# EAGLE schematic controller (EAGLE 8.4.1)
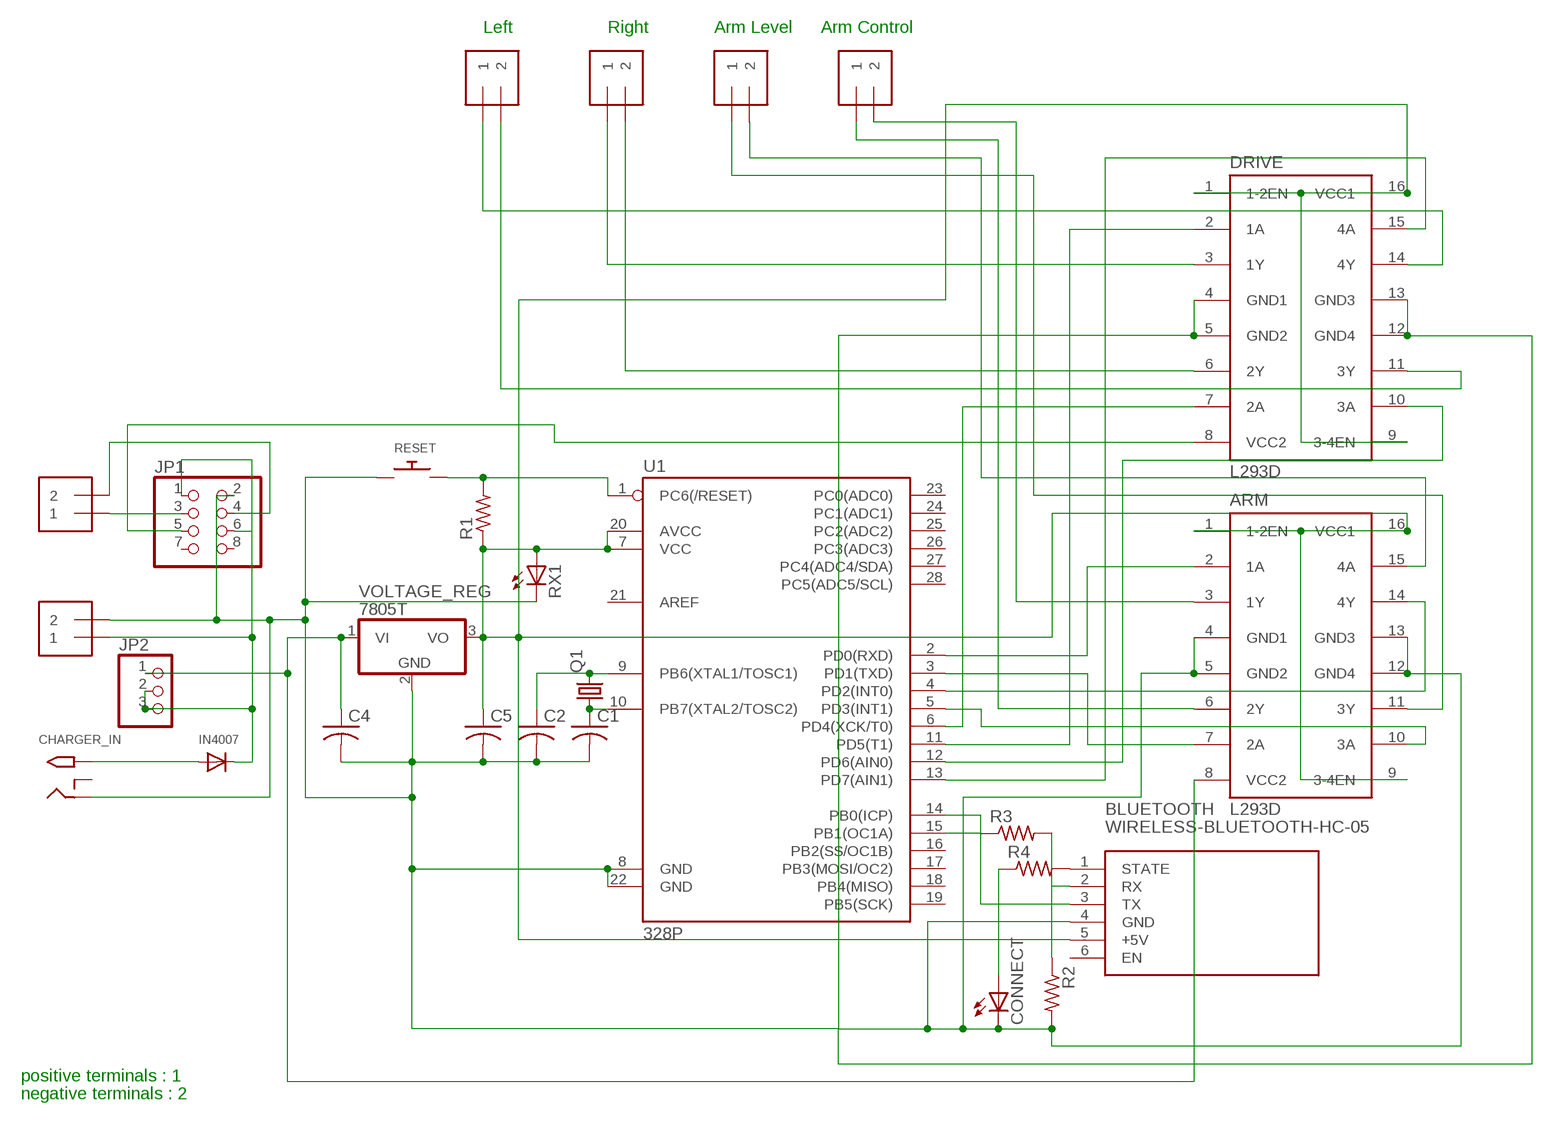
[diagram p0: schematic, sheet 1]

## Parts
ARM  L293D  [DIL16]
ARM_LEVEL  1X2-3.5MM  [1X2-3.5MM]
BATTERY_1  1X2-3.5MM  [1X2-3.5MM]
BATTERY_2  1X2-3.5MM  [1X2-3.5MM]
BLUETOOTH  WIRELESS-BLUETOOTH-HC-05  [WIRELESS-BLUETOOTH-HC-05]
C1  C-US025-025X050  [C025-025X050]
C2  C-US025-025X050  [C025-025X050]
C4  C-US050-030X075  [C050-030X075]
C5  C-US050-030X075  [C050-030X075]
CHARGER_IN  2.1MMJACKTHM  [PJ-102A]
CONNECT  LED5MM  [LED5MM]
DRIVE  L293D  [DIL16]
GRIPPER  1X2-3.5MM  [1X2-3.5MM]
IN4007  DIODEDO-1N4148  [DO-1N4148]
JP1  PINHD-2X4  [2X04]
JP2  PINHD-1X3  [1X03]
LEFT  1X2-3.5MM  [1X2-3.5MM]
Q1  CRYSTALHC49S  [HC49/S]
R1  R-US_0204/7  [0204/7]
R2  R-US_0204/7  [0204/7]
R3  R-US_0204/7  [0204/7]
R4  R-US_0204/7  [0204/7]
RESET  SWITCH_PUSHBUTTONSOFTTOUCHSMD_SJ  [PUSHBUTTON_SMD_SJ]
RIGHT  1X2-3.5MM  [1X2-3.5MM]
RX1  LED5MM  [LED5MM]
U1  328P  ATMEGA328P_PDIP  [DIP28]
VOLTAGE_REG  7805T  [TO220H]

## Nets
N$1: ARM.8(VCC2) C4.1 JP2.1 VOLTAGE_REG.1(VI)
N$2: BATTERY_2.1 IN4007.C JP1.1 JP1.6 JP2.2 JP2.3
N$3: CONNECT.A R4.1
N$4: C2.1 Q1.2 U1.9(PB6(XTAL1/TOSC1))
N$5: R1.2 RESET.P$2 U1.1(PC6(/RESET))
N$6: C1.1 Q1.1 U1.10(PB7(XTAL2/TOSC2))
N$7: BLUETOOTH.2(RX) R2.1 R3.2
N$8: BATTERY_1.1 JP1.3
N$9: BLUETOOTH.1(STATE) R4.2
N$10: R3.1 U1.15(PB1(OC1A))
N$11: ARM.7(2A) U1.3(PD1(TXD))
N$12: ARM.2(1A) U1.2(PD0(RXD))
N$13: BLUETOOTH.3(TX) U1.14(PB0(ICP))
N$14: ARM.3(1Y) GRIPPER.2
N$15: ARM.6(2Y) GRIPPER.1
N$16: ARM.14(4Y) U1.4(PD2(INT0))
N$17: ARM.10(3A) U1.5(PD3(INT1))
N$18: ARM.11(3Y) ARM_LEVEL.1
N$19: CHARGER_IN.TIP IN4007.A
N$20: ARM.15(4A) ARM_LEVEL.2
N$21: BATTERY_1.2 JP1.4
N$22: DRIVE.8(VCC2) JP1.5
N$23: ARM.1(1-2EN) ARM.9(3-4EN) ARM.16(VCC1) BLUETOOTH.5(+5V) C5.1 DRIVE.1(1-2EN) DRIVE.9(3-4EN) DRIVE.16(VCC1) R1.1 RX1.A U1.7(VCC) U1.20(AVCC) VOLTAGE_REG.3(VO)
N$24: DRIVE.7(2A) U1.6(PD4(XCK/T0))
N$25: DRIVE.2(1A) U1.11(PD5(T1))
N$26: DRIVE.10(3A) U1.12(PD6(AIN0))
N$27: DRIVE.15(4A) U1.13(PD7(AIN1))
N$28: DRIVE.14(4Y) LEFT.1
N$29: DRIVE.11(3Y) LEFT.2
N$30: DRIVE.3(1Y) RIGHT.1
N$31: DRIVE.6(2Y) RIGHT.2
N$33: ARM.4(GND1) ARM.5(GND2) ARM.12(GND4) ARM.13(GND3) BATTERY_2.2 BLUETOOTH.4(GND) C1.2 C2.2 C4.2 C5.2 CHARGER_IN.RING CONNECT.K(C) DRIVE.4(GND1) DRIVE.5(GND2) DRIVE.12(GND4) DRIVE.13(GND3) JP1.2 R2.2 RESET.P$1 RX1.K(C) U1.8(GND) U1.22(GND) VOLTAGE_REG.2(GND)
Unconnected: BLUETOOTH.6(EN) CHARGER_IN.RING_SW JP1.7 JP1.8 U1.16(PB2(SS/OC1B)) U1.17(PB3(MOSI/OC2)) U1.18(PB4(MISO)) U1.19(PB5(SCK)) U1.21(AREF) U1.23(PC0(ADC0)) U1.24(PC1(ADC1)) U1.25(PC2(ADC2)) U1.26(PC3(ADC3)) U1.27(PC4(ADC4/SDA)) U1.28(PC5(ADC5/SCL))

## Notes on the sheet
- Left | Right | Arm Level | Arm Control
- positive terminals : 1
- negative terminals : 2

## Library data of the parts
ARM DRIVE = st-microelectronics:L293D: PUSH-PULL 4 CHANNEL DRIVER; MPN: L293D; OC_FARNELL: 9589619; OC_NEWARK: 56P8249
ARM_LEVEL BATTERY_1 BATTERY_2 GRIPPER LEFT RIGHT = adafruit:1X2: 3.5mm Terminal block http://www.ladyada.net/library/pcb/eaglelibrary.html
BLUETOOTH = diy-modules:WIRELESS-BLUETOOTH-HC-05: Bluetooth Transceiver Module based on HC-05 board Tutorial is available here: https://arduino-info.wikispaces.com/BlueTooth-HC05-HC06-Modules-How-To Click here to find device on ebay.com <http://www.ebay.com/sch/hc-05+module+rs232>
C1 C2 C4 C5 = adafruit:C-US: CAPACITOR, American symbol
CHARGER_IN = adafruit:2.1MMJACK: 2.1mm x 5.5mm THM DC jack with internal switch. Digikey part #PJ-102A, 4UCON part #05537 2.1mm x 5.5mm SMT DC jack with internal switch. Digikey part #PJ-002A-SMT, 4UCON part #03267 By microbuilder.eu & adafruit.com
CONNECT RX1 = adafruit:LED: LED OSRAM: - CHIPLED LG R971, LG N971, LY N971, LG Q971, LY Q971, LO R971, LY R971 LH N974, LH R974 LS Q976, LO Q976, LY Q976 LO Q996 - Hyper CHIPLED LW Q18S LB Q993, LB Q99A, LB R99A - SideLED LS A670, LO A670, LY A670, LG A670, LP A670 LB A673, LV A673, LT A673, LW A673 LH A674 LY A675 LS A676, LA A676, LO A676, LY A676, LW A676 LS A679, LY A679, LG A679 - Hyper Micro SIDELED® LS Y876, LA Y876, LO Y876, LY Y876 LT Y87S - SmartLED LW L88C, LW L88S LB L89C, LB L89S, LG L890 LS L89K, LO L89K, LY L89K LS L896, LA L896, LO L896, LY L896 - TOPLED LS T670, LO T670, LY T670, LG T670, LP T670 LSG T670, LSP T670, LSY T670, LOP T670, LYG T670 LG T671, LOG T671, LSG T671 LB T673, LV T673, LT T673, LW T673 LH T674 LS T676, LA T676, LO T676, LY T676, LB T676, LH T676, LSB T676, LW T676 LB T67C, LV T67C, LT T67C, LS T67K, LO T67K, LY T67K, LW E67C LS E67B, LA E67B, LO E67B, LY E67B, LB E67C, LV E67C, LT E67C LW T67C LS T679, LY T679, LG T679 LS T770, LO T770, LY T770, LG T770, LP T770 LB T773, LV T773, LT T773, LW T773 LH T774 LS E675, LA E675, LY E675, LS T675 LS T776, LA T776, LO T776, LY T776, LB T776 LHGB T686 LT T68C, LB T68C - Hyper Mini TOPLED® LB M676 - Mini TOPLED Santana® LG M470 LS M47K, LO M47K, LY M47K Source: http://www.osram.convergy.de/
IN4007 = adafruit:DIODE: Diode SMADIODE - SMA Surface Mount Package 20V 1A Schottky Diode Digikey: 641-1014-6-ND DO-1N4148 - Through Hole Small Current Diode SOD-123 20V 1 A (.5mV Vf) Schottky Diode - Digikey: MBRX120TPMSCT-ND SOD-323 10V 570mA (.38mV Vf, 3ns) Schottky Diode - Digikey: ZLLS410CT-ND SOD-523 30V 30mA Schottky Diode (RB751S-40TE61) - Digikey: RB751S-40TE61CT-ND SOT23-R/W - SOT23 Package (R = Solder Paste/Reflow Ovens, W = Hand-Soldering) BAT54Film 40V 300mA - Digikey: 497-7162-1-ND
JP1 = adafruit:PINHD-2X4: PIN HEADER
JP2 = adafruit:PINHD-1X3: PIN HEADER
Q1 = adafruit:CRYSTAL: CRYSTAL; OC_FARNELL: 1667008; OC_NEWARK: unknown
R1-R4 = adafruit:R-US_: RESISTOR, American symbol
RESET = adafruit:SWITCH_PUSHBUTTON: Buttons SOFTTOUCHSMD_SJ - Soft touch temporary push button (Super Junk Akihabara) Compatible with SKPMANE010 [Mouser: 688-SKPMAN] C&K_KSS = Digikey: KSS221GLFS
U1 = SparkFun-IC-Microcontroller:ATMEGA328P_PDIP: Atmel 328P Through hole ATMEGA328P uC used in the Arduino 32kb flash, 1k EEPROM, 2k SRAM Datasheet <http://www.sparkfun.com/datasheets/Components/SMD/ATMega328.pdf> SparkFun Products Storefront component: AVR 28 Pin 20MHz 32K 6A/D - ATMega328P <https://www.sparkfun.com/products/9061> (COM-09061) SparkFun Simon Says - Through-Hole Soldering Kit <https://www.sparkfun.com/products/10547> (KIT-10547) SparkFun Learn to Solder - Simon Says <https://www.sparkfun.com/products/13708> (KIT-13708) SparkFun BigTime Watch Kit <https://www.sparkfun.com/products/11734> (KIT-11734) SparkFun ClockIt <https://www.sparkfun.com/products/10930> (KIT-10930) SparkFun Serial Enabled LCD Kit <https://www.sparkfun.com/products/10097> (LCD-10097) SparkFun Simon Tilts - Through Hole Soldering Kit <https://www.sparkfun.com/products/12634> (KIT-12634) SparkFun Frequency Counter Kit <https://www.sparkfun.com/products/10140> (KIT-10140) FabFM Radio Kit <https://www.sparkfun.com/products/11043> (KIT-11043) SparkFun Binary Blaster Kit <https://www.sparkfun.com/products/12037> (KIT-12037) SparkFun Metro-Gnome <https://www.sparkfun.com/products/9236> (KIT-09236) ATmega328 with Arduino Optiboot (Uno) <https://www.sparkfun.com/products/10524> (DEV-10524); PROD_ID: IC-09136
VOLTAGE_REG = linear:78*: Positive VOLTAGE REGULATOR Source: http://cache.national.com/ds/LM/LM78L05.pdf http://www.fairchildsemi.com/ds/LM/LM7805.pdf